# EAGLE schematic SparkFun_Level_Translator_PCA9306 (EAGLE 9.4.2)
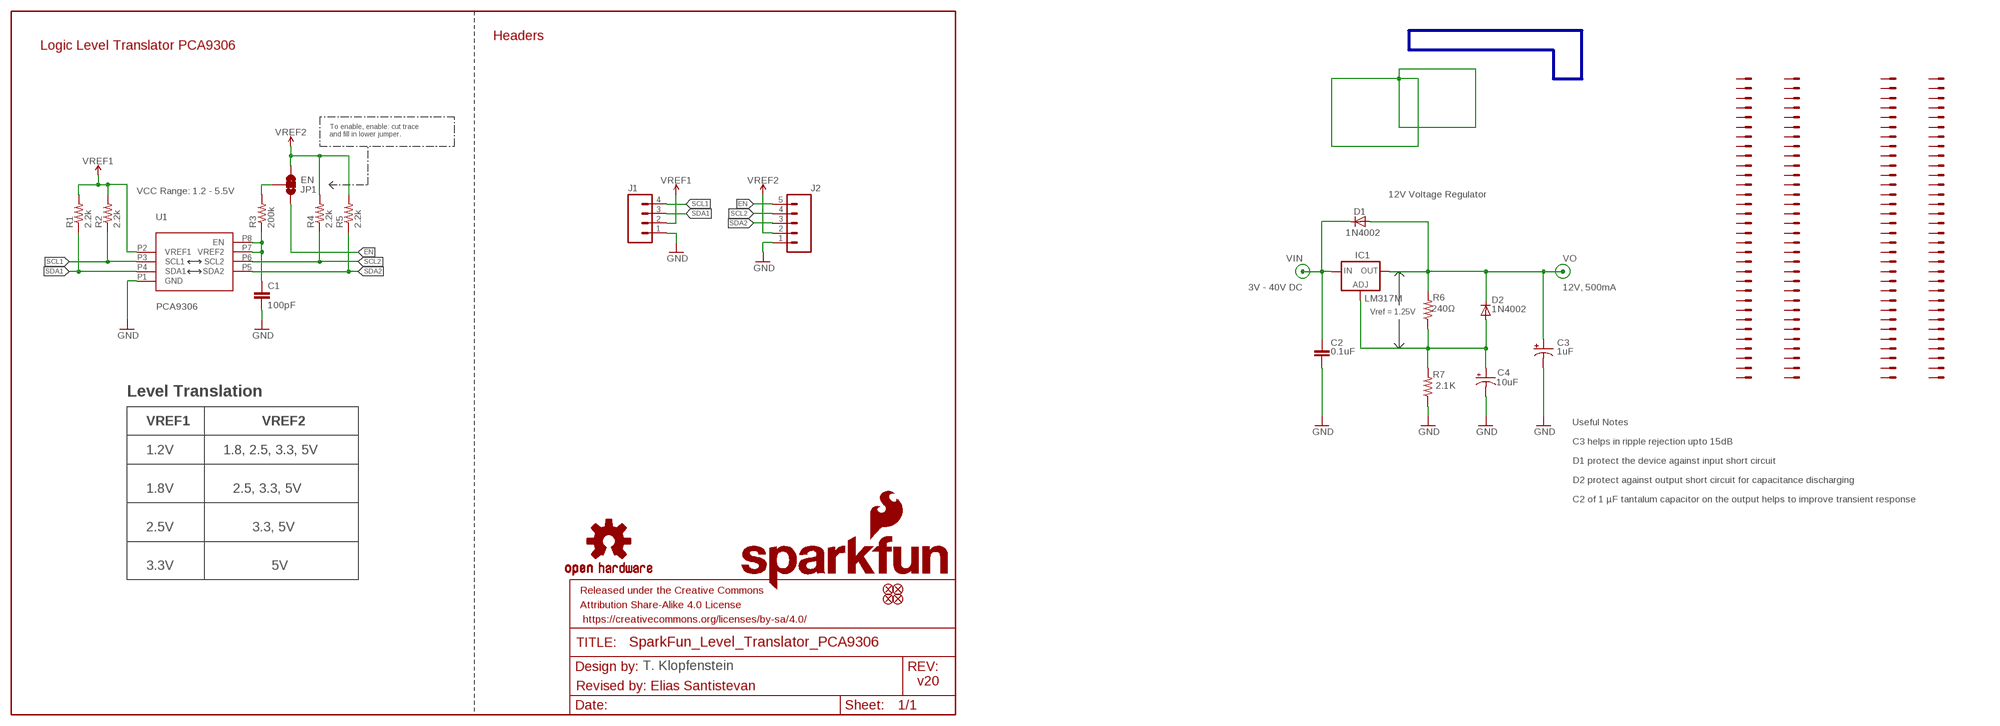
[diagram p0: schematic, sheet 1]

## Parts
C1  100pF  100PF-0603-50V-5%  [0603]
C2  0.1uF  C-EU075-052X106  [C075-052X106]
C3  1uF  CPOL-US085CS-1AR  [085CS_1AR]
C4  10uF  CPOL-US085CS-1AR  [085CS_1AR]
D1  1N4002  1N4004  [DO41-10]
D2  1N4002  1N4004  [DO41-10]
FD1  FIDUCIALUFIDUCIAL  [FIDUCIAL-MICRO]
FD2  FIDUCIALUFIDUCIAL  [FIDUCIAL-MICRO]
FD3  FIDUCIALUFIDUCIAL  [FIDUCIAL-MICRO]
FD4  FIDUCIALUFIDUCIAL  [FIDUCIAL-MICRO]
FRAME1  FRAME-LETTER  [CREATIVE_COMMONS]
IC1  LM317MBSTT3  [SOT223]
J1  CONN_041X04_NO_SILK  [1X04_NO_SILK]
J2  CONN_05NO_SILK  [1X05_NO_SILK]
J3  6HE-100-VG64AC  [6HE_100-VG64AC]
JP1  EN  JUMPER-SMT_3_1-NC_TRACE_SILK  [SMT-JUMPER_3_1-NC_TRACE_SILK]
LOGO1  OSHW-LOGOMINI  [OSHW-LOGO-MINI]
LOGO2  SFE_LOGO_NAME.1_INCH  [SFE_LOGO_NAME_.1]
LOGO3  SFE_LOGO_FLAME.1_INCH  [SFE_LOGO_FLAME_.1]
R1  2.2k  2.2KOHM-0603-1/10W-1%  [0603]
R2  2.2k  2.2KOHM-0603-1/10W-1%  [0603]
R3  200k  200KOHM-0603-1/10W-1%  [0603]
R4  2.2k  2.2KOHM-0603-1/10W-1%  [0603]
R5  2.2k  2.2KOHM-0603-1/10W-1%  [0603]
R6  240Ω  R-US_M0805  [M0805]
R7  2.1K  R-US_M0805  [M0805]
U1  PCA9306  PCA9306VSSOP_8PIN  [VSSOP_8PIN]

## Nets
EN: J2.5 JP1.1
GND: C1.2 C2.2 C3.- C4.- J1.1 J2.1 R7.1 U1.P1(GND)
JUMPER_IN: JP1.2 R3.2
N$1: C4.+ D2.A IC1.1(ADJ) R6.1 R7.2
SCL1: J1.4 R2.1 U1.P3(SCL1)
SCL2: J2.4 R4.1 U1.P6(SCL2)
SDA1: J1.3 R1.1 U1.P4(SDA1)
SDA2: J2.3 R5.1 U1.P5(SDA2)
VIN: C2.1 D1.C IC1.3(IN)
VO: C3.+ D1.A D2.C IC1.4(OUT) R6.2
VREF1: J1.2 R1.2 R2.2 U1.P2(VREF1)
VREF2: J2.2 JP1.3 R4.2 R5.2
VREF2_IN: C1.1 R3.1 U1.P7(VREF2) U1.P8(EN)
Unconnected: J3.1-A1 J3.1-A2 J3.1-A3 J3.1-A4 J3.1-A5 J3.1-A6 J3.1-A7 J3.1-A8 J3.1-A9 J3.1-A10 J3.1-A11 J3.1-A12 J3.1-A13 J3.1-A14 J3.1-A15 J3.1-A16 J3.1-A17 J3.1-A18 J3.1-A19 J3.1-A20 J3.1-A21 J3.1-A22 J3.1-A23 J3.1-A24 J3.1-A25 J3.1-A26 J3.1-A27 J3.1-A28 J3.1-A29 J3.1-A30 J3.1-A31 J3.1-A32 J3.1-C1 J3.1-C2 J3.1-C3 J3.1-C4 J3.1-C5 J3.1-C6 J3.1-C7 J3.1-C8 J3.1-C9 J3.1-C10 J3.1-C11 J3.1-C12 J3.1-C13 J3.1-C14 J3.1-C15 J3.1-C16 J3.1-C17 J3.1-C18 J3.1-C19 J3.1-C20 J3.1-C21 J3.1-C22 J3.1-C23 J3.1-C24 J3.1-C25 J3.1-C26 J3.1-C27 J3.1-C28 J3.1-C29 J3.1-C30 J3.1-C31 J3.1-C32 J3.2-A1 J3.2-A2 J3.2-A3 J3.2-A4 J3.2-A5 J3.2-A6 J3.2-A7 J3.2-A8 J3.2-A9 J3.2-A10 J3.2-A11 J3.2-A12 J3.2-A13 J3.2-A14 J3.2-A15 J3.2-A16 J3.2-A17 J3.2-A18 J3.2-A19 J3.2-A20 J3.2-A21 J3.2-A22 J3.2-A23 J3.2-A24 J3.2-A25 J3.2-A26 J3.2-A27 J3.2-A28 J3.2-A29 J3.2-A30 J3.2-A31 J3.2-A32 J3.2-C1 J3.2-C2 J3.2-C3 J3.2-C4 J3.2-C5 J3.2-C6 J3.2-C7 J3.2-C8 J3.2-C9 J3.2-C10 J3.2-C11 J3.2-C12 J3.2-C13 J3.2-C14 J3.2-C15 J3.2-C16 J3.2-C17 J3.2-C18 J3.2-C19 J3.2-C20 J3.2-C21 J3.2-C22 J3.2-C23 J3.2-C24 J3.2-C25 J3.2-C26 J3.2-C27 J3.2-C28 J3.2-C29 J3.2-C30 J3.2-C31 J3.2-C32

## Buses
B$1

## Notes on the sheet
- Headers
- Logic Level Translator PCA9306
- To enable, enable: cut trace
  and fill in lower jumper.
- VCC Range: 1.2 - 5.5V | 12V Voltage Regulator
- 3V - 40V DC | 12V, 500mA
- Vref = 1.25V
- Level Translation
- VREF1 | VREF2 | Useful Notes
- C3 helps in ripple rejection upto 15dB
- 1.2V | 1.8, 2.5, 3.3, 5V
- D1 protect the device against input short circuit
- D2 protect against output short circuit for capacitance discharging
- 1.8V | 2.5, 3.3, 5V
- C2 of 1 µF tantalum capacitor on the output helps to improve transient response
- 2.5V | 3.3, 5V
- 3.3V | 5V
- T. Klopfenstein
- v20
- Revised by: Elias Santistevan

## Library data of the parts
C1 = SparkFun-Capacitors:100PF: 100pF/0.1nF ceramic capacitors A capacitor is a passive two-terminal electrical component used to store electrical energy temporarily in an electric field.; PROD_ID: CAP-07883
C2 = rcl:C-EU: CAPACITOR, European symbol
C3 C4 = resistor:CPOL-US: POLARIZED CAPACITOR, American symbol
D1 D2 = diode:1N4004: DIODE general purpose rectifier, 1 A
FD1-FD4 = SparkFun-Aesthetics:FIDUCIAL: Fiducial Alignment Points Point-of-reference for pick-and-place machines and other optical instruments.
FRAME1 = SparkFun-Aesthetics:FRAME-LETTER: Schematic Frame - Letter Standard 8.5x11 US Letter frame
IC1 = v-reg:LM317?*: 500 mA Adjustable Output Positive Voltage Regulator Source: http://www.onsemi.co.jp .. LM317M-D.PDF; PARTNUMBER: LM317M
J1 = SparkFun-Connectors:CONN_04: Multi connection point. Often used as Generic Header-pin footprint for 0.1 inch spaced/style header connections On any of the 0.1 inch spaced packages, you can populate with these: Break Away Headers - Straight <https://www.sparkfun.com/products/116> (PRT-00116) Break Away Male Headers - Right Angle <https://www.sparkfun.com/products/553> (PRT-00553) Female Headers <https://www.sparkfun.com/products/115> (PRT-00115) Break Away Headers - Machine Pin <https://www.sparkfun.com/products/117> (PRT-00117) Break Away Female Headers - Swiss Machine Pin <https://www.sparkfun.com/products/743> (PRT-00743) For SCREWTERMINALS and SPRING TERMINALS visit here: Screw Terimnals on SparkFun.com <https://www.sparkfun.com/search/results?term=Screw+Terminals> (5mm/3.5mm/2.54mm spacing) This device is also useful as a general connection point to wire up your design to another part of your project. Our various solder wires solder well into these plated through hole pads. Hook-Up Wire - Assortment (Stranded, 22 AWG) <https://www.sparkfun.com/products/11375> (PRT-11375) Hook-Up Wire - Assortment (Solid Core, 22 AWG) <https://www.sparkfun.com/products/11367> (PRT-11367) View the entire wire category on our website here <https://www.sparkfun.com/categories/141> Special notes: Molex polarized connector foot print use with SKU : PRT-08231 with associated crimp pins and housings. 1MM SMD Version SKU: PRT-10208; PROD_ID: CONN-09696
J2 = SparkFun-Connectors:CONN_05: Multi connection point. Often used as Generic Header-pin footprint for 0.1 inch spaced/style header connections On any of the 0.1 inch spaced packages, you can populate with these: Break Away Headers - Straight <https://www.sparkfun.com/products/116> (PRT-00116) Break Away Male Headers - Right Angle <https://www.sparkfun.com/products/553> (PRT-00553) Female Headers <https://www.sparkfun.com/products/115> (PRT-00115) Break Away Headers - Machine Pin <https://www.sparkfun.com/products/117> (PRT-00117) Break Away Female Headers - Swiss Machine Pin <https://www.sparkfun.com/products/743> (PRT-00743) For SCREWTERMINALS and SPRING TERMINALS visit here: Screw Terimnals on SparkFun.com <https://www.sparkfun.com/search/results?term=Screw+Terminals> (5mm/3.5mm/2.54mm spacing) This device is also useful as a general connection point to wire up your design to another part of your project. Our various solder wires solder well into these plated through hole pads. Hook-Up Wire - Assortment (Stranded, 22 AWG) <https://www.sparkfun.com/products/11375> (PRT-11375) Hook-Up Wire - Assortment (Solid Core, 22 AWG) <https://www.sparkfun.com/products/11367> (PRT-11367) View the entire wire category on our website here <https://www.sparkfun.com/categories/141> Special notes: Molex polarized connector foot print use with SKU : PRT-08231 with associated crimp pins and housings. 1MM SMD Version SKU: PRT-10208
J3 = 19inch:6HE-?-VG64AC: Euro Card with 2 x VG-64 AC connector
JP1 = SparkFun-Jumpers:JUMPER-SMT_3_1-NC_TRACE: Normally closed trace jumper (1 of 2 connections) This jumper has a trace between two pads so it's normally closed (NC). The other connection is normally open (NO). Use a razor knife to open the connection. For best results follow the IPC guidelines for cutting traces: Cutout at least 0.063 mm (0.005 in). Remove all loose material to clean up the cut area. Seal the cut with an approved epoxy. Reapply solder to reclose the connection, or to close the NO connection.
LOGO1 = SparkFun-Aesthetics:OSHW-LOGO: Open-Source Hardware (OSHW) Logo This logo indicates the piece of hardware it is found on incorporates a OSHW license and/or adheres to the definition of open source hardware found here: http://freedomdefined.org/OSHW
LOGO2 = SparkFun-Aesthetics:SFE_LOGO_NAME: SparkFun Font Logo This is the SparkFun name logo. The logo on the schematic will always be the same size; the package variant is the height of the flame part of the logo (or the height the flame would be, if it were drawn). Default layer for the logo on the board is tSilk.
LOGO3 = SparkFun-Aesthetics:SFE_LOGO_FLAME: SparkFun Flame Logo This is the SparkFun flame logo. The logo on the schematic will always be the same size; the package variant is the height of the flame. Default layer for the logo on the board is tSilk.
R1 R2 R4 R5 = SparkFun-Resistors:2.2KOHM: 2.2kΩ resistor A resistor is a passive two-terminal electrical component that implements electrical resistance as a circuit element. Resistors act to reduce current flow, and, at the same time, act to lower voltage levels within circuits. - Wikipedia; PROD_ID: RES-08272
R3 = SparkFun-Resistors:200KOHM: 200kΩ resistor A resistor is a passive two-terminal electrical component that implements electrical resistance as a circuit element. Resistors act to reduce current flow, and, at the same time, act to lower voltage levels within circuits. - Wikipedia; PROD_ID: RES-09385
R6 R7 = resistor:R-US_: RESISTOR, American symbol
U1 = SparkFun-IC-Comms:PCA9306: Bidirectional I2C level shifter Not compatible with all available part number pinout schemes- DOUBLE CHECK!!! Variants PCA9306DC and PSOP-8 are EOL. If your part has VREF as pin 1 then this is your variant. VSSOP_8PIN is not EOL. Datasheet <https://cdn.sparkfun.com/datasheets/BreakoutBoards/PCA9306DC.pdf> SparkFun Products SparkFun Inventor's Kit for RedBot <https://www.sparkfun.com/products/12649> (ROB-12649) SparkFun RedBot Basic Kit <https://www.sparkfun.com/products/13166> (ROB-13166) SparkFun Level Translator Breakout - PCA9306 <https://www.sparkfun.com/products/11955> (BOB-11955) SparkFun Block for Intel Edison - ADC <https://www.sparkfun.com/products/13770> (DEV-13770) SparkFun Block for Intel® Edison - Raspberry Pi B <https://www.sparkfun.com/products/13044> (DEV-13044) SparkFun RedBot Sensor - Accelerometer <https://www.sparkfun.com/products/12589> (SEN-12589); PROD_ID: IC-14450